# Altium schematic sheet Actual.SchDoc
size B
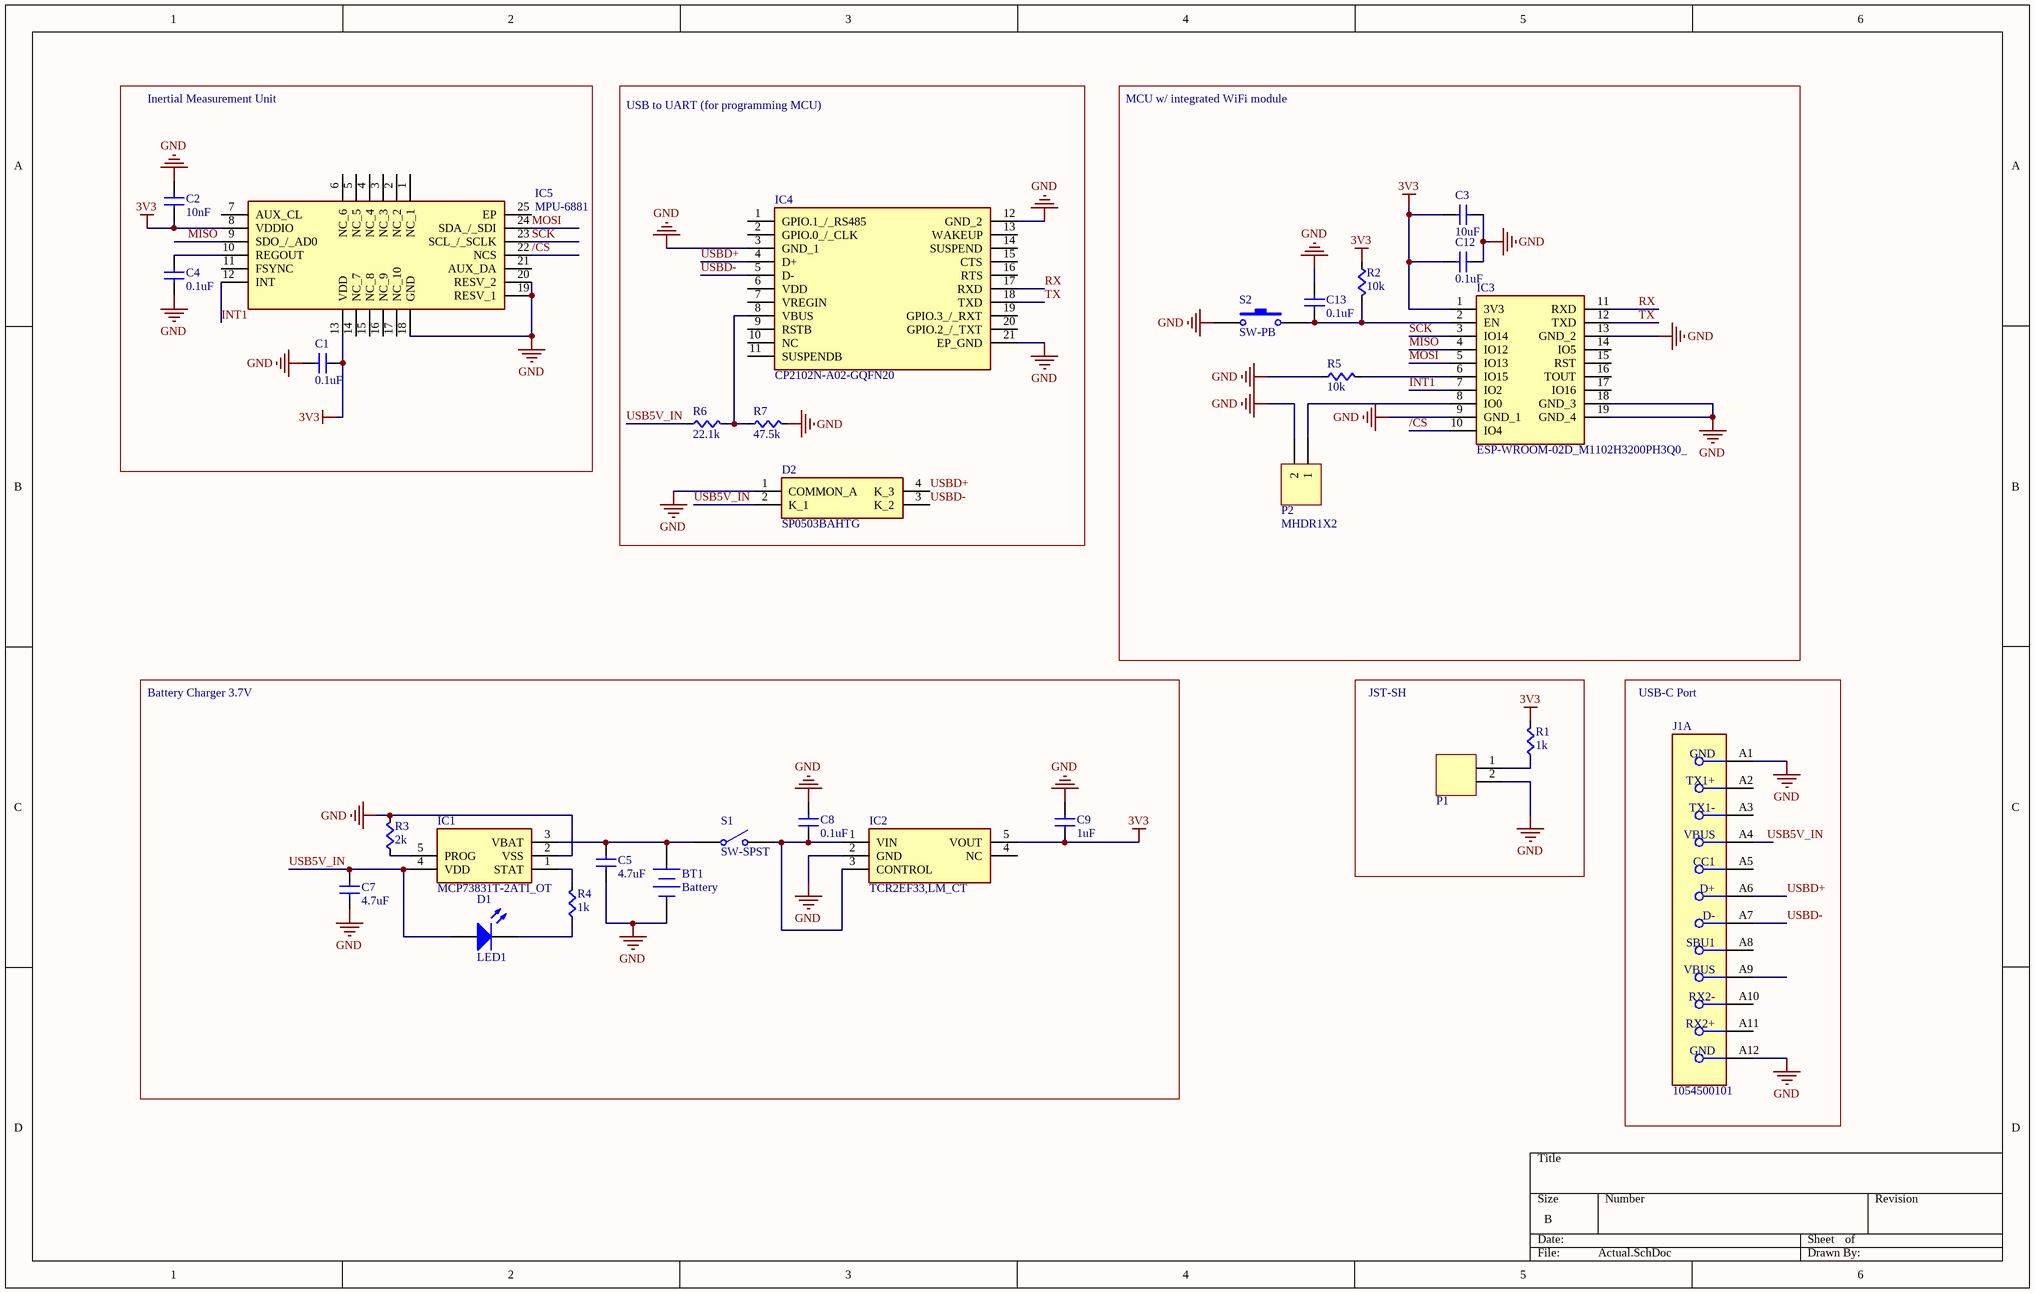
[diagram p0: Actual.SchDoc]

## Parts
BT1  Battery  [BAT-2]
C1  value 0.1uF  [CAPC0603]  (hidden comment: Cap)
C2  value 10nF  [CAPC0603]  (hidden comment: Cap)
C3  value 10uF  [CAPC0603]  (hidden comment: Cap)
C4  value 0.1uF  [CAPC0603]  (hidden comment: Cap)
C5  value 4.7uF  [CAPC0603]  (hidden comment: Cap)
C7  value 4.7uF  [CAPC0603]  (hidden comment: Cap)
C8  value 0.1uF  [CAPC0603]  (hidden comment: Cap)
C9  value 1uF  [CAPC0603]  (hidden comment: Cap)
C12  value 0.1uF  [CAPC0603]  (hidden comment: Cap)
C13  value 0.1uF  [CAPC0603]  (hidden comment: Cap)
D1  LED1  [LED-1]
D2  SP0503BAHTG  [SP0503BAHTG]
IC1  MCP73831T-2ATI_OT  [SOT95P270X145-5N]
IC2  TCR2EF33,LM_CT  [SOT-25]
IC3  ESP-WROOM-02D_M1102H3200PH3Q0_  [ESPWROOM02DM1102H3200PH3Q0]
IC4  CP2102N-A02-GQFN20  [CP2102NA02GQFN20]
IC5  MPU-6881  [QFN40P300X300X95-25N-D]
J1  1054500101  [FP-1054500101-MFG]  (part A of 3)
P1  2-pin Horz Sherlock  [MOLEX-HDR-1X2-SHERLOCK-HORZ]  (value not drawn)
P2  MHDR1X2  [MHDR1X2]
R1  value 1k  [RES0603]  (hidden comment: Res)
R2  value 10k  [RES0603]  (hidden comment: Res)
R3  value 2k  [RES0603]  (hidden comment: Res)
R4  value 1k  [RES0603]  (hidden comment: Res)
R5  value 10k  [RES0603]  (hidden comment: Res)
R6  value 22.1k  [RES0603]  (hidden comment: Res)
R7  value 47.5k  [RES0603]  (hidden comment: Res)
S1  SW-SPST  [SPST-2]
S2  SW-PB  [SPST-2]

## Blocks framed on the sheet
Inertial Measurement Unit: C1 C2 C4 IC5
USB to UART (for programming MCU): D2 IC4 R6 R7
MCU w/ integrated WiFi module: C3 C12 C13 IC3 P2 R2 R5 S2
Battery Charger 3.7V: BT1 C5 C7-C9 D1 IC1 IC2 R3 R4 S1
JST-SH: P1 R1
USB-C Port: J1

## Nets
3V3: C1.1(A) C2.1(A) C3.2(B) C9.1(A) C12.2(B) IC2.5(VOUT) IC3.1(3V3) IC5.8(VDDIO) IC5.13(VDD) R1.1(A) R2.2(B)
GND: BT1.2(-) C1.2(B) C2.2(B) C3.1(A) C4.1(A) C5.1(A) C7.1(A) C8.2(B) C9.2(B) C12.1(A) C13.2(B) D2.1(COMMON_A) IC1.2(VSS) IC2.2(GND) IC3.9(GND_1) IC3.13(GND_2) IC3.18(GND_3) IC3.19(GND_4) IC4.3(GND_1) IC4.12(GND_2) IC4.21(EP_GND) IC5.18(GND) IC5.19(RESV_1) IC5.20(RESV_2) J1.A1(GND) J1.A12(GND) P1.2 P2.2 R3.1(A) R5.2(B) R7.1(A) S2.1
/CS: IC3.10(IO4) IC5.22(NCS)
INT1: IC3.7(IO2) IC5.12(INT)
MISO: IC3.4(IO12) IC5.9(SDO_/_AD0)
MOSI: IC3.5(IO13) IC5.24(SDA_/_SDI)
RX: IC3.11(RXD) IC4.17(RXD)
SCK: IC3.3(IO14) IC5.23(SCL_/_SCLK)
TX: IC3.12(TXD) IC4.18(TXD)
USB5V_IN: C7.2(B) D1.1(A) D2.2(K_1) IC1.4(VDD) J1.A4(VBUS) R6.2(B)
USBD+: D2.4(K_3) IC4.4(D+) J1.A6(D+)
USBD-: D2.3(K_2) IC4.5(D-) J1.A7(D-)
NetBT1_1: BT1.1(+) C5.2(B) IC1.3(VBAT) S1.1(COMMON)
NetC4_2: C4.2(B) IC5.10(REGOUT)
NetC8_1: C8.1(A) IC2.1(VIN) IC2.3(CONTROL) S1.2(NO)
NetC13_1: C13.1(A) IC3.2(EN) R2.1(A) S2.2
NetD1_2: D1.2(K) R4.2(B)
NetIC1_1: IC1.1(STAT) R4.1(A)
NetIC1_5: IC1.5(PROG) R3.2(B)
NetIC3_6: IC3.6(IO15) R5.1(A)
NetIC3_8: IC3.8(IO0) P2.1
NetIC4_8: IC4.8(VBUS) R6.1(A) R7.2(B)
NetP1_1: P1.1 R1.2(B)

Not connected (* = marked no-connect by the designer): IC2 4(NC); IC3 14(IO5) 15(RST) 16(TOUT) 17(IO16); IC4 1(GPIO.1_/_RS485) 2(GPIO.0_/_CLK) 6(VDD) 7(VREGIN) 9(RSTB) 10(NC) 11(SUSPENDB) 13(WAKEUP) 14(SUSPEND) 15(CTS) 16(RTS) 19(GPIO.3_/_RXT) 20(GPIO.2_/_TXT); IC5 1(NC_1) 2(NC_2) 3(NC_3) 4(NC_4) 5(NC_5) 6(NC_6) 7(AUX_CL) 11(FSYNC) 14(NC_7) 15(NC_8) 16(NC_9) 17(NC_10) 21(AUX_DA) 25(EP); J1 A2(TX1+) A3(TX1-) A5(CC1) A8(SBU1) A9(VBUS) A10(RX2-) A11(RX2+)

## Library data of the parts
BT1 = Battery: Multicell Battery; Published: 24-Mar-1999; LatestRevisionDate: 17-Jul-2002; LatestRevisionNote: Re-released for DXP Platform.; PackageReference: BAT-2; Publisher: Altium Limited; PackageDescription: Battery; 2 Leads
D1 = LED1: Typical RED GaAs LED; Published: 8-Jun-2000; LatestRevisionDate: 08-Jul-2005; LatestRevisionNote: Mech Layer 1 removed.; PackageReference: LED-1; Publisher: Altium Limited; PackageDescription: LED; 2 Leads
D2 = SP0503BAHTG: TVS Diode (Uni-directional); Manufacturer_Name: LITTELFUSE; Datasheet Link: https://nl.mouser.com/datasheet/2/240/Littelfuse_TVS_Diode_Array_SP05_Datasheet.pdf-777043.pdf; Height: 1.22mm; Manufacturer_Part_Number: SP0503BAHTG; Mouser Part Number: 576-SP0503BAHTG; Mouser Price/Stock: https://www.mouser.co.uk/ProductDetail/Littelfuse/SP0503BAHTG?qs=uD%2FdkN7XIa0NTYXwHdELYA%3D%3D; Arrow Part Number: SP0503BAHTG; Arrow Price/Stock: https://www.arrow.com/en/products/sp0503bahtg/littelfuse?region=nac
IC1 = MCP73831T-2ATI_OT: Integrated Circuit; Manufacturer_Name: Microchip; Manufacturer_Part_Number: MCP73831T-2ATI/OT; Datasheet Link: https://componentsearchengine.com//MCP73831T-2ATI_OT.pdf; Height: 1.45mm; Mouser2 Part Number: 579-MCP73831T-2ATIOT; Mouser2 Price/Stock: https://www.mouser.com/Search/Refine.aspx?Keyword=579-MCP73831T-2ATIOT
IC2 = TCR2EF33,LM_CT: Integrated Circuit; Manufacturer_Name: Toshiba; Manufacturer_Part_Number: TCR2EF33,LM(CT; Datasheet Link: https://componentsearchengine.com//TCR2EF33,LM(CT.pdf; Mouser2 Part Number: 757-TCR2EF33LMCT; Mouser2 Price/Stock: https://www.mouser.com/Search/Refine.aspx?Keyword=757-TCR2EF33LMCT
IC3 = ESP-WROOM-02D_M1102H3200PH3Q0_: Integrated Circuit; Manufacturer_Name: Espressif Systems; Manufacturer_Part_Number: ESP-WROOM-02D(M1102H3200PH3Q0); Datasheet Link: https://www.mouser.com.tr/datasheet/2/891/esp-wroom-02d_esp-wroom-02u_datasheet_en-1365835.pdf; Height: 3.3mm; Mouser Part Number: 356-ESPWROOM02D(4MB); Mouser Price/Stock: https://www.mouser.co.uk/ProductDetail/Espressif-Systems/ESP-WROOM-02DM1102H3200PH3Q0?qs=W%2FMpXkg%252BdQ6VfEEQ948I3Q%3D%3D
IC4 = CP2102N-A02-GQFN20: Integrated Circuit; Manufacturer_Name: Silicon Labs; Datasheet Link: https://www.silabs.com/documents/public/data-sheets/cp2102n-datasheet.pdf; Height: 0.8mm; Manufacturer_Part_Number: CP2102N-A02-GQFN20; Mouser Part Number: 634-CP2102NA02GQFN20; Mouser Price/Stock: https://www.mouser.co.uk/ProductDetail/Silicon-Labs/CP2102N-A02-GQFN20?qs=u16ybLDytRaG8WdlP0fT2g%3D%3D; Arrow Part Number: CP2102N-A02-GQFN20; Arrow Price/Stock: https://www.arrow.com/en/products/cp2102n-a02-gqfn20/silicon-labs?region=nac
IC5 = MPU-6881: Integrated Circuit; Manufacturer_Name: TDK; Datasheet Link: https://www.semiconductorstore.com/Images/Items/Uploaded/0236/mpu-6881-a7be4.pdf; Height: 0.95mm; Manufacturer_Part_Number: MPU-6881; Mouser Part Number: 410-MPU-6881; Mouser Price/Stock: https://www.mouser.co.uk/ProductDetail/TDK-InvenSense/MPU-6881?qs=u4fy%2FsgLU9MthFpyRcZ0%252Bg%3D%3D; Arrow Part Number: MPU-6881; Arrow Price/Stock: https://www.arrow.com/en/products/mpu-6881/invensense?region=nac
J1 = CMP-04767-000004-1: CONN RCP USB3.1 TYPEC 24P SMD RA; Manufacturer: Molex; Number Of Contacts: 24; Voltage Rating: 30V; Shielding: true; Is Female: yes; Current Rating: 0.25/1.25/5A; Pitch: 0.5mm; Conn Orientation: Right Angle; Package: 0; Height: 3.44mm; Footprint Url: https://www.molex.com/pdm_docs/sd/1054500101_sd.pdf; Device Class L1: Connectors; Category: Conn; Device Class L2: USB Connectors; Digikey Description: CONN RCP USB3.1 TYPEC 24P SMD RA; Contact Material: Gold,Nickel; Mouser Description: USB Shielded I/O Receptacle; Type C; Right Angle; Surface Mount; Gold over Nickel; ComponentLink2Description: Datasheet; Lead Free: Yes; Automotive: No; Temperature Range High: +85°C; RoHS: TRUE; Octopart: https://octopart.com/105450-0101-molex-68082325; ComponentLink2URL: https://www.molex.com/webdocs/datasheets/pdf/en-us/1054500101_IO_CONNECTORS.pdf; Temperature: -30°C to +85°C; Usb Standard: USB 3.1; Temperature Range Low: -30°C; Device Class L3: unset; Manufacturer Part Number: 1054500101
P1 = MOLEX-HDR-1x2-SHERLOCK_RA: Header, Molex, 2mm Pitch Sherlock Header, Single Row, Horizontal, 2 Circuits, Length 3.3mm,  0353630260; Manufacturer: Molex Inc; Manufacturer Part Number: 0353630260; Supplier Part Number 1: WM18931-ND; Supplier 1: Digi-Key
P2 = MHDR1X2: Header, 2-Pin; LatestRevisionDate: 17-Jul-2002; LatestRevisionNote: Re-released for DXP Platform.; Publisher: Altium Limited
S1 = SW-SPST: Single-Pole, Single-Throw Switch; Published: 24-Mar-1999; LatestRevisionDate: 17-Jul-2002; LatestRevisionNote: Re-released for DXP Platform.; PackageReference: SPST-2; Publisher: Altium Limited; PackageDescription: Switch; 2 Leads
S2 = SW-PB: Switch; Published: 24-Mar-1999; LatestRevisionDate: 17-Jul-2002; LatestRevisionNote: Re-released for DXP Platform.; PackageReference: SPST-2; Publisher: Altium Limited; PackageDescription: Switch; 2 Leads
C1-C5 C7-C9 C12 C13 = Cap: Supplier 1: Digi-Key; Supplier Part Number 1: 1276-1000-1-ND
R1-R7 = Res: Supplier 1: Digi-Key; Supplier Part Number 1: RMCF0603JT10K0CT-ND